# EAGLE design RainGaugeDropin (EAGLE 9.0.1)
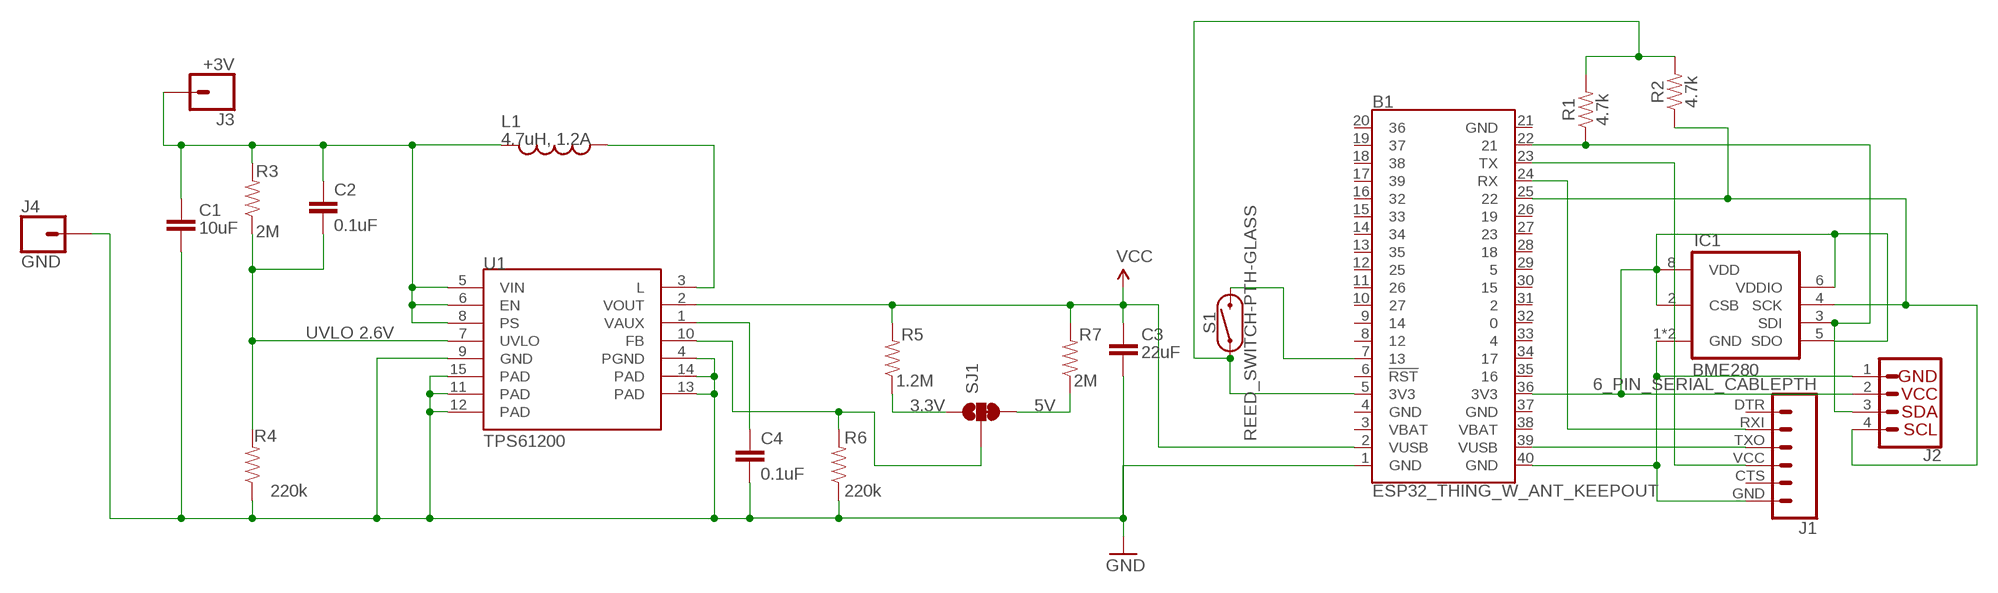
[diagram p0: schematic, sheet 1]

## Parts
B1  ESP32_THING_W_ANT_KEEPOUT  [ESP32_THING]
C1  10uF  CAP1206  [1206]
C2  0.1uF  CAP0603-CAP  [0603-CAP]
C3  22uF  CAP0805  [0805]
C4  0.1uF  CAP0603-CAP  [0603-CAP]
IC1  BME280  [BME280]
J1  6_PIN_SERIAL_CABLEPTH  [FTDI_BASIC]
J2  QWIIC_CONNECTORJS-1MM  [1X04_1MM_RA]
J3  +3V  CONN_01OFFSET  [1X01_OFFSET]
J4  GND  CONN_01OFFSET  [1X01_OFFSET]
L1  4.7uH, 1.2A  INDUCTOR.  [CDRH2D09]
R1  4.7k  4.7KOHM-0603-1/10W-1%  [0603]
R2  4.7k  4.7KOHM-0603-1/10W-1%  [0603]
R3  2M  RESISTOR0603-RES  [0603-RES]
R4  220k  RESISTOR0603-RES  [0603-RES]
R5  1.2M  RESISTOR0603-RES  [0603-RES]
R6  220k  RESISTOR0603-RES  [0603-RES]
R7  2M  RESISTOR0603-RES  [0603-RES]
S1  REED_SWITCH-PTH-GLASS  [REED_SWITCH_GLASS]
SJ1  SOLDERJUMPER_2WAYPASTE2&3  [SJ_3_PASTE2&3]
U1  TPS61200  [QFN-10_PAD]

## Nets
3.3V: R5.1 SJ1.1
5V: R7.1 SJ1.3
FB: R6.2 SJ1.2 U1.10(FB)
GND: B1.1(GND) C1.2 C3.2 C4.2 J4.1 R4.1 R6.1 U1.4(PGND) U1.9(GND) U1.11(PAD) U1.12(PAD) U1.13(PAD) U1.14(PAD) U1.15(PAD)
N$1: B1.40(GND) IC1.1(GND) IC1.7(GND) J1.GND J2.1(GND)
N$2: B1.36(3V3) IC1.2(CSB) IC1.5(SDO) IC1.6(VDDIO) IC1.8(VDD) J2.2(VCC)
N$3: B1.25 IC1.4(SCK) J2.4(SCL) R2.1
N$4: L1.P$1 U1.3(L)
N$5: B1.22 IC1.3(SDI) J2.3(SDA) R1.1
N$6: B1.39(VUSB) J1.VCC
N$7: B1.7 S1.P$2
N$8: C4.1 U1.1(VAUX)
N$9: B1.23(TX) J1.TXO
N$10: B1.5(3V3) R1.2 R2.2 S1.P$1
N$11: B1.24(RX) J1.RXI
UVLO: C2.2 R3.1 R4.2 U1.7(UVLO)
VCC: B1.2(VUSB) C3.1 R5.2 R7.2 U1.2(VOUT)
VIN: C1.1 C2.1 J3.1 L1.P$2 R3.2 U1.5(VIN) U1.6(EN) U1.8(PS)
Unconnected: B1.3(VBAT) B1.4(GND) B1.6(!RST!) B1.8 B1.9 B1.10 B1.11 B1.12 B1.13 B1.14 B1.15 B1.16 B1.17 B1.18 B1.19 B1.20 B1.21(GND) B1.26 B1.27 B1.28 B1.29 B1.30 B1.31 B1.32 B1.33 B1.34 B1.35 B1.37(GND) B1.38(VBAT) J1.CTS J1.DTR

## Notes on the sheet
- UVLO 2.6V

## Library data of the parts
B1 = SparkFun-Boards:ESP32_THING: SparkFun ESP32 Thing Board Pins, silkscreen, and logos matching the layout of the SparkFun ESP32 Thing <https://www.sparkfun.com/products/13907> Dimensions: 2.32" x 1.00"; SF_ID: DEV-13907
C1 C3 = CH_passive:CAP: Capacitor Standard 0603 ceramic capacitor, and 0.1" leaded capacitor.
C2 C4 = SparkFun:CAP: Capacitor Standard 0603 ceramic capacitor, and 0.1" leaded capacitor.
IC1 = bosch-bme280:BME280: DIGITAL HUMIDITY, PRESSURE AND TEMPERATURE SENSOR * Digital interface I²C (up to 3.4 MHz) and SPI (3 and 4 wire, up to 10 MHz)* Supply voltage VDD main supply voltage range: 1.71 V to 3.6 V*VDDIO interface voltage range: 1.2 V to 3.6 V Operating range -40…+85 °C, 0…100 % rel. humidity, 300…1100 hPa The library has been designed by Richard Magdycz <https://www.facebook.com/groups/eaglecadsoftUK>
J1 = SparkFun-Connectors:6_PIN_SERIAL_CABLE: 6-pin header connection for use with the "FTDI BASIC" pinout - CABLE SIDE. Also known as "Arduino Serial Program Header". This is used on a design to provide a 6-pin connection point for serial communication usually from a USB cable (D+/D-) to these headers (RX/TX). It also has the remaining pins necessary for programming in the Arduino evironment (DTR, GND, and sometimes VCC). Note, this device has "CABLE" in the name. It is intended to be used on a design that usually lives on the end of your USB cable and prvides the converter chip (FTDI232 or FTDI231x) to commnicate serial RX/TX. The "sister" device, named "TARGET" is inteneded to be used on a design that contains a target micro-controller that you wish to program. You can populate with some of these: Female Headers <https://www.sparkfun.com/products/115> (PRT-00115) For reference (or to suit your programming needs) check out these designs: SparkFun FTDI Basic Breakout - 5V <https://www.sparkfun.com/products/9716> (DEV-09716) SparkFun FTDI Basic Breakout - 3.3V <https://www.sparkfun.com/products/9873> (DEV-09873) SparkFun FTDI SmartBasic <https://www.sparkfun.com/products/12935> (DEV-12935) SparkFun Beefy 3 - FTDI Basic Breakout <https://www.sparkfun.com/products/13746> (DEV-13746)
J2 = SparkFun-Connectors:QWIIC_CONNECTOR: SparkFun I2C Standard Qwiic Connector An SMD 1mm pitch JST connector makes it easy and quick (get it? Qwiic?) to connect I2C devices to each other. The Qwiic system <http://www.sparkfun.com/qwiic> enables fast and solderless connection between popular platforms and various sensors and actuators. We carry 200mm <https://www.sparkfun.com/products/14204>, 100mm <https://www.sparkfun.com/products/14205>, 50mm <https://www.sparkfun.com/products/14206>, and breadboard friendly <https://www.sparkfun.com/products/14207> Qwiic cables. We also offer 10 pcs strips <https://www.sparkfun.com/products/14323> the SMD connectors.
J3 J4 = SparkFun-Connectors:CONN_01: Single connection point. Often used as Generic Header-pin footprint for 0.1 inch spaced/style header connections On any of the 0.1 inch spaced packages, you can populate with these: Break Away Headers - Straight <https://www.sparkfun.com/products/116> (PRT-00116) Break Away Male Headers - Right Angle <https://www.sparkfun.com/products/553> (PRT-00553) Female Headers <https://www.sparkfun.com/products/115> (PRT-00115) Break Away Headers - Machine Pin <https://www.sparkfun.com/products/117> (PRT-00117) Break Away Female Headers - Swiss Machine Pin <https://www.sparkfun.com/products/743> (PRT-00743) This device is also useful as a general connection point to wire up your design to another part of your project. Our various solder wires solder well into these plated through hole pads. Hook-Up Wire - Assortment (Stranded, 22 AWG) <https://www.sparkfun.com/products/11375> (PRT-11375) Hook-Up Wire - Assortment (Solid Core, 22 AWG) <https://www.sparkfun.com/products/11367> (PRT-11367) View the entire wire category on our website here <https://www.sparkfun.com/categories/141> Special notes: SMTSO-256-ET is a "flush mount" nut for a 4-40 screw. We mostly use this on specialty testbeds; it is a nice way to connect hardware to your PCB at an adjustable hieght. Also note, the SNAP packages are for using a snappable style connector. We sell a baggie of snaps and they are also used on two LilyPad designs: Snap Assortment - 30 pack (male and female) <https://www.sparkfun.com/products/11347> (DEV-11347) LilyPad Arduino SimpleSnap <https://www.sparkfun.com/products/10941> (DEV-10941) LilyPad SimpleSnap Protoboard <https://www.sparkfun.com/products/10940> (DEV-10940)
L1 = SparkFun:INDUCTOR: Inductors Basic Inductor/Choke - 0603 and 1206. Footprints are not proven and vary greatly between part numbers.
R1 R2 = SparkFun-Resistors:4.7KOHM: 4.7kΩ resistor A resistor is a passive two-terminal electrical component that implements electrical resistance as a circuit element. Resistors act to reduce current flow, and, at the same time, act to lower voltage levels within circuits. - Wikipedia; PROD_ID: RES-07857
R3-R7 = SparkFun:RESISTOR: Resistor Basic schematic elements and footprints for 0603, 1206, and PTH resistors.
S1 = SparkFun-Switches:REED_SWITCH: Reed Switch A reed switch is a magnetically-actuated switch. When the device is exposed to a magnetic field, the two ferrous materials inside the switch pull together and the switch closes. Variant Overview PTH-GLASS Reed Switch <https://www.sparkfun.com/products/8642> (COM-08642) - PTH reed switch w/ glass body (6.0 x 0.9 mm) PTH-INSULATED Reed Switch - Insulated <https://www.sparkfun.com/products/10601> (COM-10601) - PTH reed switch w/ insulated body (15.1 x 4.2 mm); PROD_ID: SWCH-09282; SF_SKU: COM-08642
SJ1 = SparkFun:SOLDERJUMPER_2WAY: Solder Jumper 2 way solder jumper
U1 = SparkFun:TPS61200: DC to DC Booster

## Board
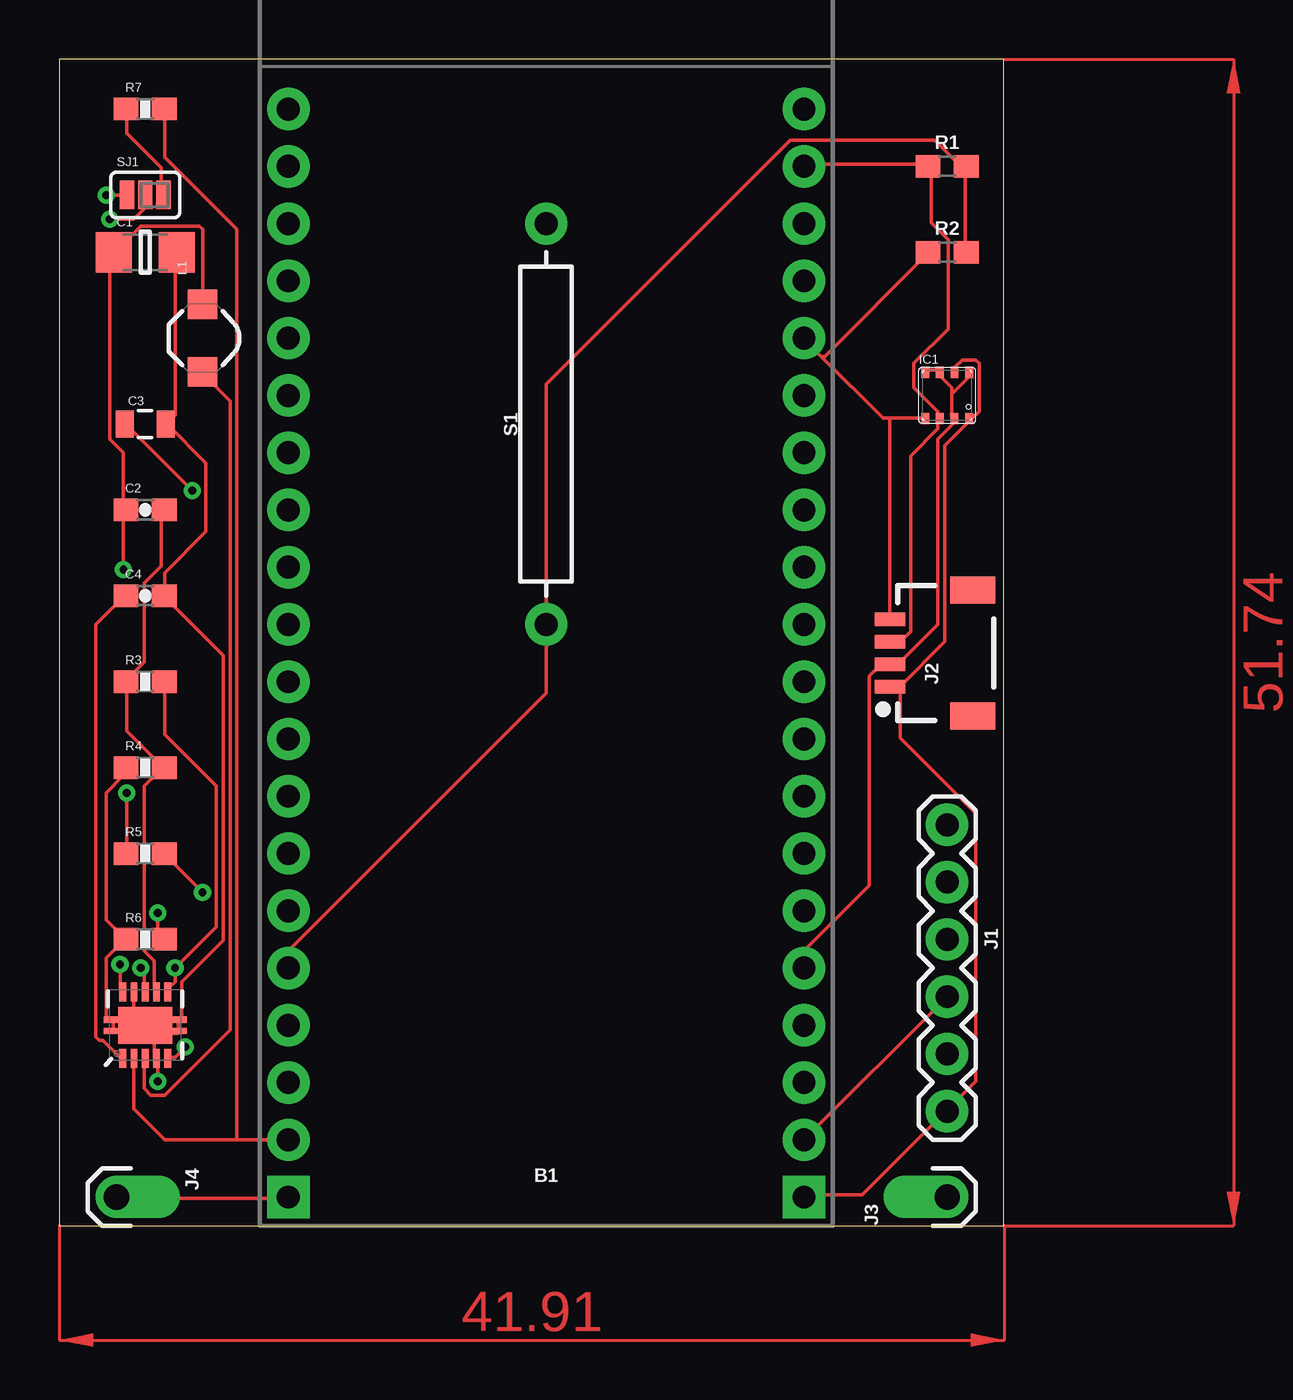
[diagram p1: board, top side]
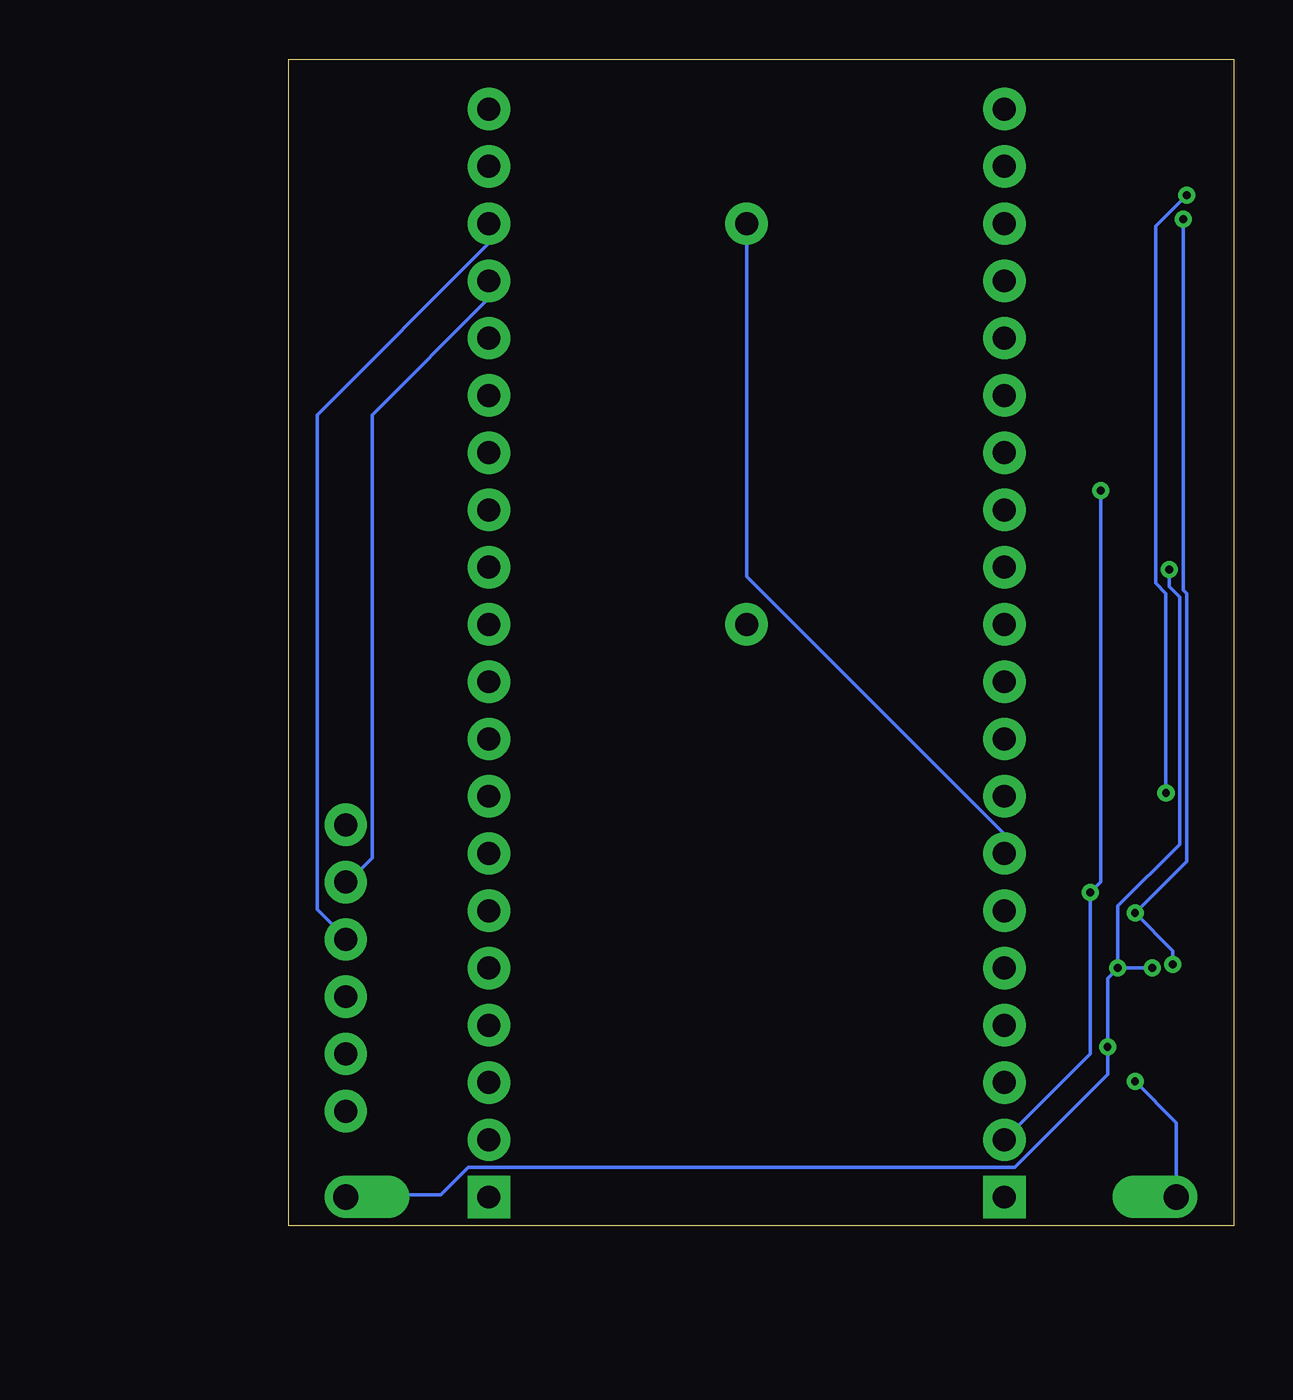
[diagram p2: board, bottom side, seen from below]

Size 41.89 x 51.74 mm. Coordinates in mm from the lower left corner, seen from the top.
Outline: 0,0 41.89,0 41.89,51.74 0,51.74 0,0
Copper layers (1*16): Top 0.035mm / dielectric 1.5mm / Bottom 0.035mm
Design rules "default": minimum track width 6mil, minimum drill 0.35mm, track to track 6mil, track to pad 6mil, pad to pad 6mil, via to via 6mil, smd to smd 6mil, copper to edge 40mil, drill to drill 6mil, minimum pad ring 10mil, minimum via ring 8mil, stop-mask expansion 4mil, vias tented up to drill 0mil, thermal gap 10mil

### Footprints (pad centres in the part's own frame; a part is rotated, then mirrored left to right if it is on the bottom)
ESP32_THING = drill 1.016 pad 1.88 square: 1 1.27,1.27; 40 24.13,1.27 | drill 1.016 pad 1.88: 2 1.27,3.81; 3 1.27,6.35; 4 1.27,8.89; 5 1.27,11.43; 6 1.27,13.97; 7 1.27,16.51; 8 1.27,19.05; 9 1.27,21.59; 10 1.27,24.13; 11 1.27,26.67; 12 1.27,29.21; 13 1.27,31.75; 14 1.27,34.29; 15 1.27,36.83; 16 1.27,39.37; 17 1.27,41.91; 18 1.27,44.45; 19 1.27,46.99; 20 1.27,49.53; 21 24.13,49.53; 22 24.13,46.99; 23 24.13,44.45; 24 24.13,41.91; 25 24.13,39.37; 26 24.13,36.83; 27 24.13,34.29; 28 24.13,31.75; 29 24.13,29.21; 30 24.13,26.67; 31 24.13,24.13; 32 24.13,21.59; 33 24.13,19.05; 34 24.13,16.51; 35 24.13,13.97; 36 24.13,11.43; 37 24.13,8.89; 38 24.13,6.35; 39 24.13,3.81
1206 = smd 1.6 x 1.8: 1 -1.4,0; 2 1.4,0
0603-CAP = smd 1.1 x 1: 1 -0.85,0; 2 0.85,0
0805 = smd 0.8 x 1.2: 1 -0.9,0; 2 0.9,0
BME280 = smd 0.35 x 0.5: 1 0.975,-1.025; 2 0.325,-1.025; 3 -0.325,-1.025; 4 -0.975,-1.025; 5 -0.975,1.025; 6 -0.325,1.025; 7 0.325,1.025; 8 0.975,1.025
FTDI_BASIC = drill 1.016 pad 1.88: CTS 10.16,0; DTR 0,0; GND 12.7,0; RXI 2.54,0; TXO 5.08,0; VCC 7.62,0
1X04_1MM_RA = smd 0.6 x 1.35: 1 -1.5,0; 2 -0.5,0; 3 0.5,0; 4 1.5,0 | smd 1.2 x 2: NC1 2.8,-3.675; NC2 -2.8,-3.675
1X01_OFFSET = drill 1.118 pad 1.88 offset: 1 0,0
CDRH2D09 = smd 1.3 x 1.3: P$1 -1.5,0; P$2 1.5,0
0603 = smd 1.1 x 1: 1 -0.85,0; 2 0.85,0
0603-RES = smd 1.1 x 1: 1 -0.85,0; 2 0.85,0
REED_SWITCH_GLASS = drill 1.016 pad 1.88: P$1 -8.89,0; P$2 8.89,0
SJ_3_PASTE2&3 = smd 0.635 x 1.27: 1 -0.813,0; 2 0,0; 3 0.813,0
QFN-10_PAD = smd 0.297 x 0.85: 1 -1,-1.475; 2 -0.5,-1.475; 3 0,-1.475; 4 0.5,-1.475; 5 1,-1.475; 6 1,1.475; 7 0.5,1.475; 8 0,1.475; 9 -0.5,1.475; 10 -1,1.475 | smd 0.7 x 0.28: 11 -1.5,0.25; 12 -1.5,-0.25; 13 1.5,0.25; 14 1.5,-0.25 | smd 2.4 x 1.65: 15 0,0

### Placement (x,y rotation side)
B1  8.89,0 0 top
C1  3.81,43.18 0 top
C2  3.81,31.75 0 top
C3  3.81,35.56 0 top
C4  3.81,27.94 0 top
IC1  39.37,36.83 0 top
J1  39.37,17.78 270 top
J2  36.83,25.4 90 top
J3  39.37,1.27 90 top
J4  2.54,1.27 270 top
L1  6.35,39.37 90 top
R1  39.37,46.99 0 top
R2  39.37,43.18 0 top
R3  3.81,24.13 0 top
R4  3.81,20.32 0 top
R5  3.81,16.51 0 top
R6  3.81,12.7 0 top
R7  3.81,49.53 0 top
S1  21.59,35.56 90 top
SJ1  3.81,45.72 0 top
U1  3.81,8.89 0 top

### Tracks (layer width: path | path; a pad name or v marks a point on that pad's centre or on a via)
3.3V  (via drill 0.35)
  Top 0.152: v3,19.2 3,16.61 R5.1 | SJ1.1 v2.08,45.72
  Bottom 0.152: v3,19.2 3,28.04 3.45,28.5 3.45,44.35 v2.08,45.72
5V
  Top 0.152: R7.1 3,49.53 3,48.46 4.52,46.94 4.52,45.72 SJ1.3
FB  (via drill 0.35)
  Top 0.152: v2.69,11.58 2.69,10.52 U1.10 | v4.37,13.87 4.37,12.95 4.52,12.8 R6.2 | v2.23,44.65 3.3,44.65 3.76,45.11 3.76,45.72 SJ1.2
  Bottom 0.152: v2.69,11.58 2.69,12.19 v4.37,13.87 2.08,16.15 2.08,28.04 2.23,28.19 v2.23,44.65
GND  (via drill 0.35)
  Top 0.152: J4.1 2.54,1.22 10.16,1.22 B1.1 | 2.39,9.14 2.39,8.69 U1.12 | 4.22,8.53 4.22,7.47 U1.4 4.37,7.32 v4.37,6.4 | 4.22,8.53 3.91,8.84 U1.15 | 3.3,9.45 U1.9 | 3.3,9.45 3.76,8.99 U1.15 | 2.39,9.14 3,9.14 3.3,9.45 | 2.39,9.14 U1.11 2.23,9.14 2.08,9.3 2.08,11.89 2.85,12.65 R6.1 2.85,12.8 2.08,13.56 2.08,19.2 2.85,19.96 2.85,20.27 R4.1 | 3.3,9.45 U1.15 | 4.22,8.53 5.28,8.53 U1.14 5.28,8.69 5.28,9.14 U1.13 5.44,9.14 5.44,10.82 7.26,12.65 7.26,25.3 4.67,27.89 C4.2 4.67,28.04 4.67,28.96 6.5,30.79 6.5,33.83 4.83,35.51 C3.2 4.83,35.66 5.13,35.97 5.13,43.13 C1.2 | 4.22,8.53 U1.15
  Bottom 0.152: J4.1 2.54,4.57 v4.37,6.4
N$1
  Top 0.152: IC1.7 39.73,37.95 39.73,38.1 40.03,38.41 40.64,38.41 40.79,38.25 40.79,36.12 40.49,35.81 IC1.1 40.33,35.66 39.27,34.59 39.27,25.91 37.29,23.93 | 37.29,23.93 36.83,23.93 J2.1 37.29,23.93 | B1.40 33.02,1.37 35.61,1.37 39.27,5.03 J1.GND 39.42,5.18 40.64,6.4 40.64,18.29 37.29,21.64 37.29,23.93
N$2
  Top 0.152: IC1.5 38.51,37.95 38.96,37.95 IC1.6 38.96,37.8 39.57,37.19 39.57,36.88 | 39.57,36.88 39.57,35.81 IC1.2 39.73,35.66 38.96,34.9 38.96,26.67 37.29,24.99 36.83,24.99 J2.2 36.83,24.84 36.37,24.84 35.92,24.38 35.92,15.09 33.02,12.19 B1.36 | 39.57,36.88 40.33,37.64 40.33,37.8 IC1.8
N$3
  Top 0.152: 36.83,35.81 36.52,35.81 33.78,38.56 | 36.83,35.81 38.35,35.81 IC1.4 | 33.78,38.56 33.02,39.32 B1.25 | 33.78,38.56 33.93,38.56 38.51,43.13 R2.1 | 36.83,35.81 J2.4
N$4
  Top 0.152: U1.3 3.76,7.32 3.76,6.1 4.06,5.79 4.67,5.79 7.57,8.69 7.57,36.58 6.35,37.8 L1.P$1
N$5
  Top 0.152: B1.22 33.02,47.09 38.51,47.09 R1.1 38.66,46.94 38.66,44.5 39.42,43.74 39.42,39.78 37.9,38.25 37.9,37.19 38.96,36.12 38.96,35.81 IC1.3 38.96,35.66 38.96,35.36 37.74,34.14 37.74,26.36 37.29,25.91 J2.3
N$6
  Top 0.152: J1.VCC B1.39
N$7
  Bottom 0.152: B1.7 10.16,17.37 21.59,28.8 S1.P$2
N$8
  Top 0.152: U1.1 2.69,7.47 1.93,8.23 1.78,8.23 1.63,8.38 1.63,26.67 2.85,27.89 C4.1
N$9
  Bottom 0.152: B1.23 33.02,43.59 40.64,35.97 40.64,14.02 39.42,12.8 J1.TXO
N$10
  Top 0.152: R2.2 40.18,43.28 40.18,46.94 R1.2 40.18,47.09 39.88,47.09 38.81,48.16 32.41,48.16 21.59,37.34 S1.P$1 21.59,23.62 10.16,12.19 B1.5
N$11
  Bottom 0.152: B1.24 33.02,41.15 38.2,35.97 38.2,16.31 39.27,15.24 J1.RXI
UVLO
  Top 0.152: U1.7 4.22,10.52 4.22,11.73 3.76,12.19 3.76,19.51 4.52,20.27 R4.2 4.52,20.42 3,21.95 3,24.08 R3.1 3,24.23 3.76,24.99 3.76,28.5 4.52,29.26 4.52,31.7 C2.2
VCC  (via drill 0.35)
  Top 0.152: B1.2 7.87,3.81 | 7.87,3.81 4.67,3.81 3.3,5.18 3.3,7.32 U1.2 | v6.35,14.78 4.67,16.46 R5.2 | 7.87,3.81 7.87,44.2 4.67,47.4 4.67,49.53 R7.2 | v5.89,32.61 3,35.51 C3.1
  Bottom 0.152: B1.2 6.35,7.62 v6.35,14.78 5.89,15.24 v5.89,32.61
VIN  (via drill 0.35)
  Top 0.152: L1.P$2 6.35,44.2 6.2,44.35 3.61,44.35 2.54,43.28 C1.1 2.39,43.13 2.23,42.98 2.23,34.9 2.85,34.29 2.85,31.85 C2.1 2.85,31.7 v2.85,29.11 | v5.59,7.92 5.13,7.47 4.83,7.47 U1.5 | U1.6 4.83,10.52 5.13,10.82 v5.13,11.43 6.96,13.26 6.96,19.51 4.67,21.79 4.67,24.08 R3.2 | v3.61,11.43 3.76,11.28 3.76,10.52 U1.8
  Bottom 0.152: v5.13,11.43 5.59,10.97 v5.59,7.92 5.59,6.71 9.7,2.59 33.93,2.59 35.15,1.37 39.27,1.37 J3.1 | v5.13,11.43 v3.61,11.43 | v2.85,29.11 2.85,28.35 2.39,27.89 2.39,16.92 5.13,14.17 v5.13,11.43
(copper drawn outside any net)
  shapes: Top area x2